# Altium schematic sheet basketball_robot_connection_strip_2018.SchDoc
size A4
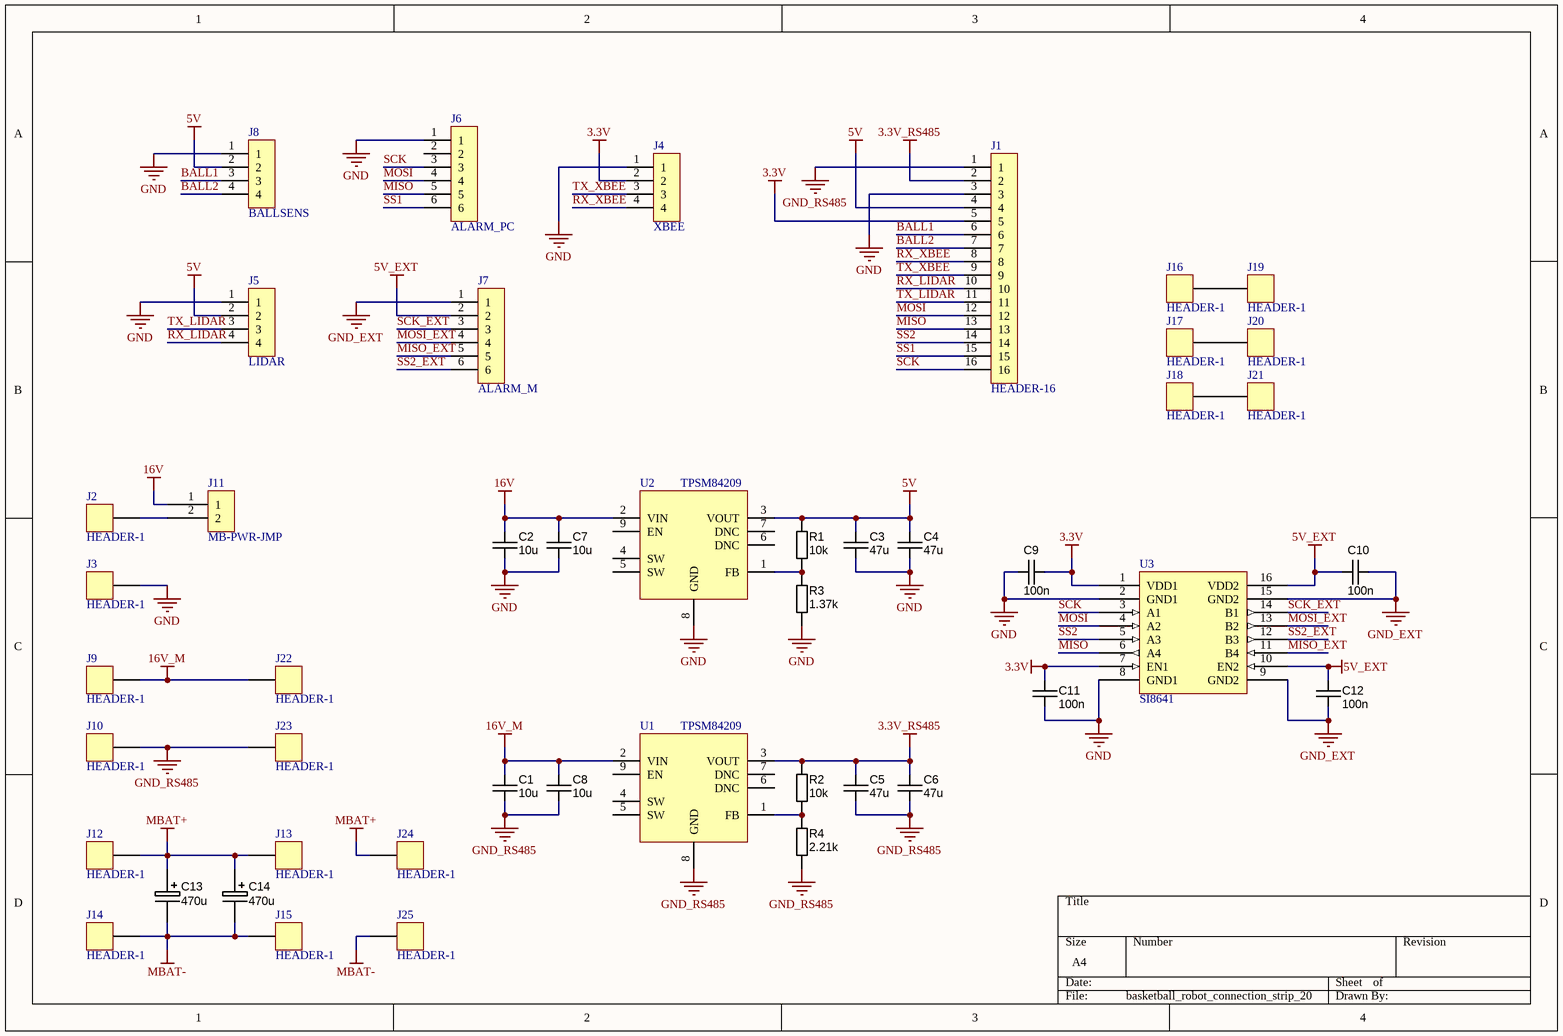
[diagram p0: basketball_robot_connection_strip_2018.SchDoc]

## Parts
C1  10u  [CAPC3216X180N]
C2  10u  [CAPC3216X180N]
C3  47u  [CAPC3216X180N]
C4  47u  [CAPC3216X180N]
C5  47u  [CAPC3216X180N]
C6  47u  [CAPC3216X180N]
C7  10u  [CAPC3216X180N]
C8  10u  [CAPC3216X180N]
C9  100n  [CAPC1608X90N]
C10  100n  [CAPC1608X90N]
C11  100n  [CAPC1608X90N]
C12  100n  [CAPC1608X90N]
C13  470u  [CAPE10.0MM_Rad_10x14mm]
C14  470u  [CAPE10.0MM_Rad_10x14mm]
J1  HEADER-16  [MICRO-MATCH-MOB-16]
J2  HEADER-1  [2MM-BULLET-PLUG-VIA]
J3  HEADER-1  [2MM-BULLET-PLUG-VIA]
J4  XBEE  [MICRO-MATCH-FOB-04]
J5  LIDAR  [MICRO-MATCH-FOB-04]
J6  ALARM_PC  [MICRO-MATCH-MOB-06]
J7  ALARM_M  [MICRO-MATCH-MOB-06]
J8  BALLSENS  [MICRO-MATCH-FOB-04]
J9  HEADER-1  [POWER-PAD-4x3]
J10  HEADER-1  [POWER-PAD-4x3]
J11  MB-PWR-JMP  [PIN-HEADER-2]
J12  HEADER-1  [2MM-BULLET-PLUG-VIA]
J13  HEADER-1  [POWER-PAD-4x3]
J14  HEADER-1  [2MM-BULLET-PLUG-VIA]
J15  HEADER-1  [POWER-PAD-4x3]
J16  HEADER-1  [2MM-BANANA-VIA]
J17  HEADER-1  [2MM-BANANA-VIA]
J18  HEADER-1  [2MM-BANANA-VIA]
J19  HEADER-1  [POWER-PAD-4x3]
J20  HEADER-1  [POWER-PAD-4x3]
J21  HEADER-1  [POWER-PAD-4x3]
J22  HEADER-1  [2MM-BULLET-PLUG-VIA]
J23  HEADER-1  [2MM-BULLET-PLUG-VIA]
J24  HEADER-1  [2MM-BULLET-PLUG-VIA]
J25  HEADER-1  [2MM-BULLET-PLUG-VIA]
R1  10k  [RESC1608X55N]
R2  10k  [RESC1608X55N]
R3  1.37k  [RESC1608X55N]
R4  2.21k  [RESC1608X55N]
U1  TPSM84209  [TPSM84209]
U2  TPSM84209  [TPSM84209]
U3  SI8641  [SOIC16]

## Nets
3.3V: C9.1 C11.2 J1.5 J4.2 U3.1(VDD1) U3.7(EN1)
3.3V_RS485: C5.1 C6.1 J1.2 R2.1 U1.3(VOUT)
5V: C3.1 C4.1 J1.4 J5.2 J8.2 R1.1 U2.3(VOUT)
5V_EXT: C10.1 C12.2 J7.2 U3.10(EN2) U3.16(VDD2)
16V: C2.1 C7.1 J11.1 U2.2(VIN)
16V_M: C1.1 C8.1 J9.1 J22.1 U1.2(VIN)
GND: C2.2 C3.2 C4.2 C7.2 C9.2 C11.1 J1.3 J3.1 J4.1 J5.1 J6.1 J8.1 R3.2 U2.8(GND) U3.2(GND1) U3.8(GND1)
GND_EXT: C10.2 C12.1 J7.1 U3.9(GND2) U3.15(GND2)
GND_RS485: C1.2 C5.2 C6.2 C8.2 J1.1 J10.1 J23.1 R4.2 U1.8(GND)
MBAT+: C13.1 C14.1 J12.1 J13.1 J24.1
MBAT-: C13.2 C14.2 J14.1 J15.1 J25.1
BALL1: J1.6 J8.3
BALL2: J1.7 J8.4
MISO: J1.13 J6.5 U3.6(A4)
MISO_EXT: J7.5 U3.11(B4)
MOSI: J1.12 J6.4 U3.4(A2)
MOSI_EXT: J7.4 U3.13(B2)
RX_LIDAR: J1.10 J5.4
RX_XBEE: J1.8 J4.4
SCK: J1.16 J6.3 U3.3(A1)
SCK_EXT: J7.3 U3.14(B1)
SS1: J1.15 J6.6
SS2: J1.14 U3.5(A3)
SS2_EXT: J7.6 U3.12(B3)
TX_LIDAR: J1.11 J5.3
TX_XBEE: J1.9 J4.3
NetJ2_1: J2.1 J11.2
NetJ16_1: J16.1 J19.1
NetJ17_1: J17.1 J20.1
NetJ18_1: J18.1 J21.1
NetR1_2: R1.2 R3.1 U2.1(FB)
NetR2_2: R2.2 R4.1 U1.1(FB)

Not connected (* = marked no-connect by the designer): J6 2; U1 4(SW) 5(SW) 6(DNC) 7(DNC) 9(EN); U2 4(SW) 5(SW) 6(DNC) 7(DNC) 9(EN)

## Library data of the parts
C1-C8 = CAPC_10u_1206_10V: Capacitor SMD Cer 10uF 10% 10V X5R 1206; Manufacturer 1: KEMET; Manufacturer Part Number 1: C1206C106K8PACTU; Ratings: 10V; X5R; Material: ceramic; Value: 10µ; SCDType: undef; Package / Case: 1206 (3216 metric); Tolerance: ±10%; Supplier 1: Digi-Key; Supplier Part Number 1: C1206C106K8PACTU-ND
C9-C12 = CAPC_100n_0603_X7R_50V_10%: Capacitor SMD Cer 100nF 10% 50V X7R 0603; Manufacturer 1: AVX Corporation; Manufacturer Part Number 1: 06035C104KAT2A; Ratings: 50V; X7R; Material: ceramic; SCDType: spec; Manufacturer 2: TDK Corporation; Manufacturer Part Number 2: C1608X7R1H104K; Package / Case: 0603 (1608 Metric); Tolerance: ±10%; Supplier 1: Digi-Key; Supplier Part Number 1: 478-5052-1-ND; ComponentLink1URL: http://www.avx.com/docs/Catalogs/cx7r.pdf; ComponentLink1Description: http://www.avx.com/docs/Catalogs/cx7r.pdf; Supplier 2: Digi-Key; Supplier Part Number 2: 445-1314-1-ND; ComponentLink2URL: http://product.tdk.com/capacitor/mlcc/en/documents/mlcc_commercial_general_en.pdf; ComponentLink2Description: http://product.tdk.com/capacitor/mlcc/en/documents/mlcc_commercial_general_en.pdf; Value: 100n
C13 C14 = CAPE_470u_16V_THT: Capacitor THT Alum Elec 470uF 20% 16V; Manufacturer 1: NICHICON; Manufacturer Part Number 1: UHM1C471MPD6; Ratings: 16V; 105°C; Material: Al Electrolytic; SCDType: undef; Value: 470µ; Package / Case: Radial; Tolerance: ±20%; Supplier 1: Newark; Supplier Part Number 1: 54K8151; Manufacturer 2: JD; Manufacturer Part Number 2: GT470UF16V_10x12mm
J4 J5 J8 = HEADER-4
J6 J7 = HEADER-6
J11 = HEADER-2
R1-R4 = RES_10K_0603_1%: Resistor SMD chip 10k Ohm 0.1W 1% 0603; Manufacturer 1: Yageo; Manufacturer Part Number 1: RC0603FR-0710KL; Ratings: 1/10W; SCDType: spec; Package / Case: 0603 (1608 Metric); Supplier 1: Digi-Key; Supplier Part Number 1: 311-10.0KHRCT-ND; Tolerance: ±1%; Value: 10K